# EAGLE design arduino_Uno_mod (EAGLE 8.3.2)
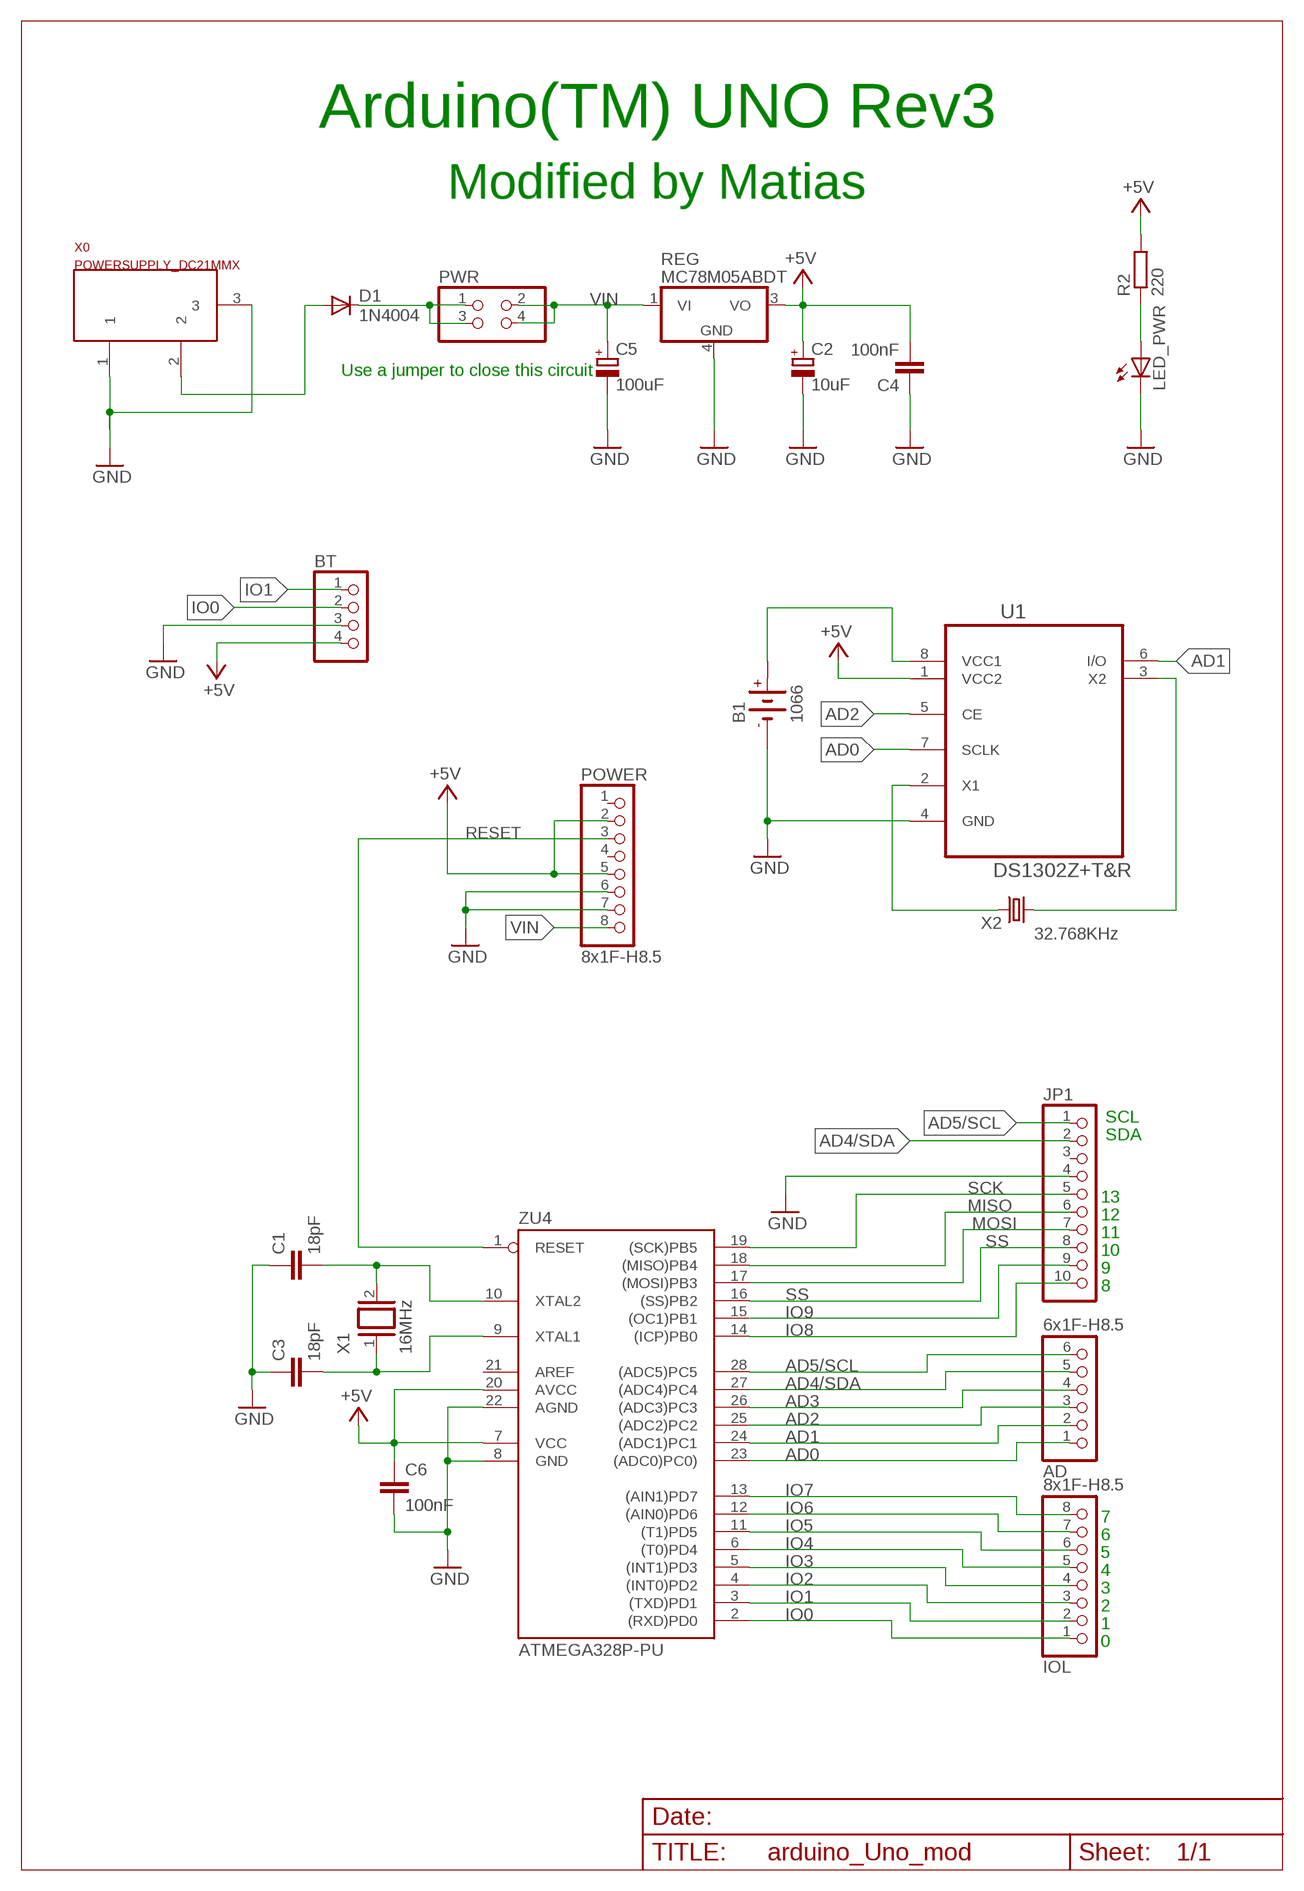
[diagram p0: schematic, sheet 1]

## Parts
AD  6x1F-H8.5  PINHD-1X6  [1X06]
B1  1066  [1066]
BT  PINHD-1X4/90  [1X04/90]
C1  18pF  C-EU025-025X050  [C025-025X050]
C2  10uF  CPOL-EUE2.5-5  [E2,5-5]
C3  18pF  C-EU025-025X050  [C025-025X050]
C4  100nF  C-EU025-025X050  [C025-025X050]
C5  100uF  CPOL-EUE2-5  [E2-5]
C6  100nF  C-EU025-025X050  [C025-025X050]
D1  1N4004  [DO41-10]
IOL  8x1F-H8.5  PINHD-1X8  [1X08]
JP1  PINHD-1X10  [1X10]
LED_PWR  LED3MM  [LED3MM]
POWER  8x1F-H8.5  PINHD-1X8  [1X08]
PWR  PINHD-2X2  [2X02]
R2  220  R-EU_R1206  [R1206]
REG  MC78M05ABDT  [DPACK_3]
U1  DS1302Z+T&R  [SOIC127P600X175-8N]
X0  POWERSUPPLY_DC21MMX  [POWERSUPPLY_DC-21MM]
X1  16MHz  XTAL/S  [QS]
X2  32.768KHz  CRYSTALS-NOGND-WATCH-3X8  [WATCH-3X8]
ZU4  ATMEGA328P-PU  [DIL28-3]

## Nets
+5V [usbvcc]: BT.4 C2.+ C4.2 C6.1 POWER.2 POWER.5 R2.2 REG.3(VO) U1.1(VCC2) ZU4.7(VCC) ZU4.20(AVCC)
AD0: AD.1 U1.7(SCLK) ZU4.23((ADC0)PC0))
AD1: AD.2 U1.6(I/O) ZU4.24((ADC1)PC1)
AD2: AD.3 U1.5(CE) ZU4.25((ADC2)PC2)
AD3: AD.4 ZU4.26((ADC3)PC3)
AD4/SDA: AD.5 JP1.2 ZU4.27((ADC4)PC4)
AD5/SCL: AD.6 JP1.1 ZU4.28((ADC5)PC5)
GND [gnd]: B1.- BT.3 C1.1 C2.- C3.1 C4.1 C5.- C6.2 JP1.4 LED_PWR.K(C) POWER.6 POWER.7 REG.4(GND) U1.4(GND) X0.1 X0.3 ZU4.8(GND) ZU4.22(AGND)
IN [power]: D1.A X0.2
IO0: BT.2 IOL.1 ZU4.2((RXD)PD0)
IO1: BT.1 IOL.2 ZU4.3((TXD)PD1)
IO2: IOL.3 ZU4.4((INT0)PD2)
IO3: IOL.4 ZU4.5((INT1)PD3)
IO4: IOL.5 ZU4.6((T0)PD4)
IO5: IOL.6 ZU4.11((T1)PD5)
IO6: IOL.7 ZU4.12((AIN0)PD6)
IO7: IOL.8 ZU4.13((AIN1)PD7)
IO8: JP1.10 ZU4.14((ICP)PB0)
IO9: JP1.9 ZU4.15((OC1)PB1)
MISO: JP1.6 ZU4.18((MISO)PB4)
MOSI: JP1.7 ZU4.17((MOSI)PB3)
N$1: C3.2 X1.1 ZU4.9(XTAL1)
N$2: LED_PWR.A R2.1
N$4: D1.C PWR.1 PWR.3
N$5: B1.+ U1.8(VCC1)
N$6: U1.2(X1) X2.2
N$7: U1.3(X2) X2.1
RESET: POWER.3 ZU4.1(RESET)
SCK: JP1.5 ZU4.19((SCK)PB5)
SS: JP1.8 ZU4.16((SS)PB2)
VIN [power]: C5.+ POWER.8 PWR.2 PWR.4 REG.1(VI)
XTAL2: C1.2 X1.2 ZU4.10(XTAL2)
Unconnected: JP1.3 POWER.1 POWER.4 ZU4.21(AREF)

## Notes on the sheet
- Arduino(TM) UNO Rev3
- Modified by Matias
- Use a jumper to close this circuit
- SCL
- SDA
- 13
- 12
- 11
- 10
- 9
- 8
- 7
- 6
- 5
- 4
- 3
- 2
- 1
- 0

## Library data of the parts
AD = SmartPrj:PINHD-1X6: PIN HEADER
B1 = 1066:1066: Keystone 1066 Li Coin Cell Holder; AVAILABILITY: Bad; DESCRIPTION: Mini DC/DC Step-Down _Buck_ Converter - 3.3V @ 1A output - TSR12433; MF: Greenlee Communications; MP: 1066; PACKAGE: None; PRICE: 13.82 USD
BT = pinhead:PINHD-1X4: PIN HEADER
C1 C3 C4 C6 = rcl:C-EU: CAPACITOR, European symbol
C2 C5 = rcl:CPOL-EU: POLARIZED CAPACITOR, European symbol
D1 = diode:1N4004: DIODE general purpose rectifier, 1 A
IOL POWER = SmartPrj:PINHD-1X8: PIN HEADER
JP1 = pinhead:PINHD-1X10: PIN HEADER
LED_PWR = led:LED: LED OSRAM: - CHIPLED LG R971, LG N971, LY N971, LG Q971, LY Q971, LO R971, LY R971 LH N974, LH R974 LS Q976, LO Q976, LY Q976 LO Q996 - Hyper CHIPLED LW Q18S LB Q993, LB Q99A, LB R99A - SideLED LS A670, LO A670, LY A670, LG A670, LP A670 LB A673, LV A673, LT A673, LW A673 LH A674 LY A675 LS A676, LA A676, LO A676, LY A676, LW A676 LS A679, LY A679, LG A679 - Hyper Micro SIDELED® LS Y876, LA Y876, LO Y876, LY Y876 LT Y87S - SmartLED LW L88C, LW L88S LB L89C, LB L89S, LG L890 LS L89K, LO L89K, LY L89K LS L896, LA L896, LO L896, LY L896 - TOPLED LS T670, LO T670, LY T670, LG T670, LP T670 LSG T670, LSP T670, LSY T670, LOP T670, LYG T670 LG T671, LOG T671, LSG T671 LB T673, LV T673, LT T673, LW T673 LH T674 LS T676, LA T676, LO T676, LY T676, LB T676, LH T676, LSB T676, LW T676 LB T67C, LV T67C, LT T67C, LS T67K, LO T67K, LY T67K, LW E67C LS E67B, LA E67B, LO E67B, LY E67B, LB E67C, LV E67C, LT E67C LW T67C LS T679, LY T679, LG T679 LS T770, LO T770, LY T770, LG T770, LP T770 LB T773, LV T773, LT T773, LW T773 LH T774 LS E675, LA E675, LY E675, LS T675 LS T776, LA T776, LO T776, LY T776, LB T776 LHGB T686 LT T68C, LB T68C - Hyper Mini TOPLED® LB M676 - Mini TOPLED Santana® LG M470 LS M47K, LO M47K, LY M47K Source: http://www.osram.convergy.de LUXEON: - LUMILED® LXK2-PW12-R00, LXK2-PW12-S00, LXK2-PW14-U00, LXK2-PW14-V00 LXK2-PM12-R00, LXK2-PM12-S00, LXK2-PM14-U00 LXK2-PE12-Q00, LXK2-PE12-R00, LXK2-PE12-S00, LXK2-PE14-T00, LXK2-PE14-U00 LXK2-PB12-K00, LXK2-PB12-L00, LXK2-PB12-M00, LXK2-PB14-N00, LXK2-PB14-P00, LXK2-PB14-Q00 LXK2-PR12-L00, LXK2-PR12-M00, LXK2-PR14-Q00, LXK2-PR14-R00 LXK2-PD12-Q00, LXK2-PD12-R00, LXK2-PD12-S00 LXK2-PH12-R00, LXK2-PH12-S00 LXK2-PL12-P00, LXK2-PL12-Q00, LXK2-PL12-R00 Source: www.luxeon.com KINGBRIGHT: KA-3528ASYC Source: www.kingbright.com
PWR = pinhead:PINHD-2X2: PIN HEADER
R2 = rcl:R-EU_: RESISTOR, European symbol
REG = linear:MC78M: 500 mA Positive Voltage Regulators Source: Data sheet <http://www.onsemi.com/pub_link/Collateral/MC78M00-D.PDF>
U1 = DS1302Z_T_R:DS1302Z+T&R: Trickle-Charge Timekeeping Chip; AVAILABILITY: Good; DESCRIPTION: Real Time Clock Serial 31Byte 8-Pin SOIC N T/R; MF: Maxim Integrated; MP: DS1302Z+T&amp;R; PACKAGE: SOIC-8 Maxim Integrated; PRICE: 1.99 USD
X0 = SmartPrj:POWERSUPPLY_DC21MM
X1 = special:XTAL/S: CRYSTAL
X2 = IQD-Frequency-Products:CRYSTALS-NOGND: CRYSTALS CAN NOT GROUNDED
ZU4 = SmartPrj:ATMEGA328P-: MICROCONTROLLER 4 Kbytes FLASH 128 bytes SRAM 256 bytes EEPROM UART 6-channel 10 bit ADC

## Net classes
0 default: width 0.254 mm, clearance 0.254 mm
1 power: width 0.61 mm, drill 0.61 mm, clearance 0.254 mm
2 gnd: width 0.305 mm, drill 0.559 mm, clearance 0.254 mm
3 usbvcc: width 0.508 mm, drill 0.61 mm, clearance 0.254 mm
4 aref: width 0.406 mm, drill 0.61 mm, clearance 0.254 mm

## Board
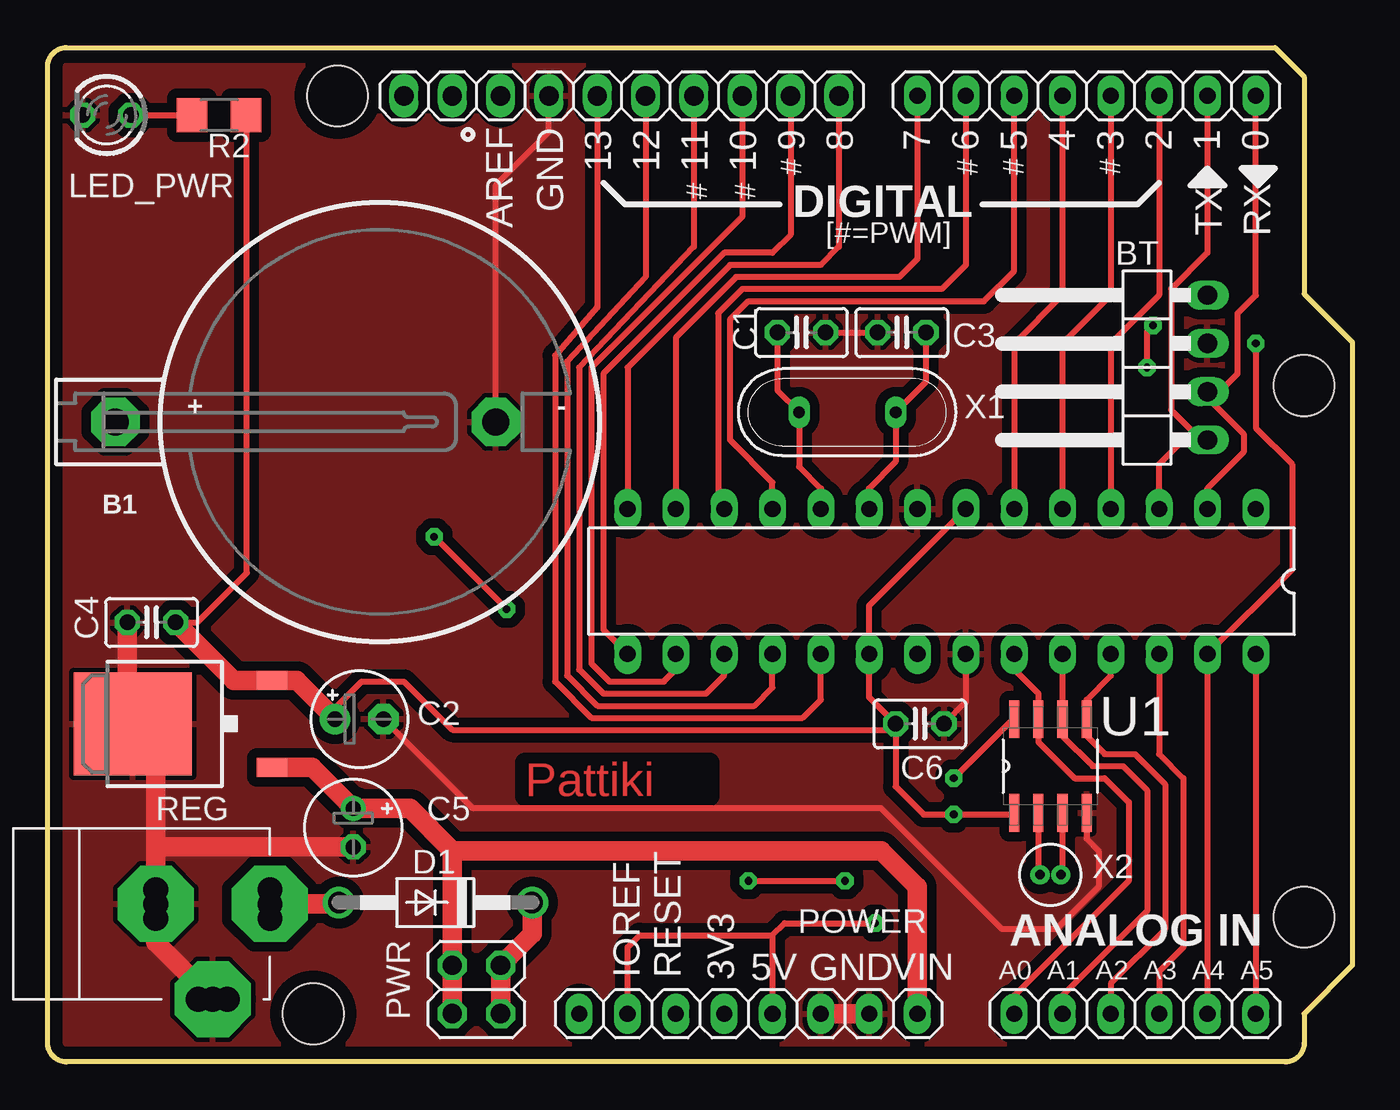
[diagram p1: board, top side]
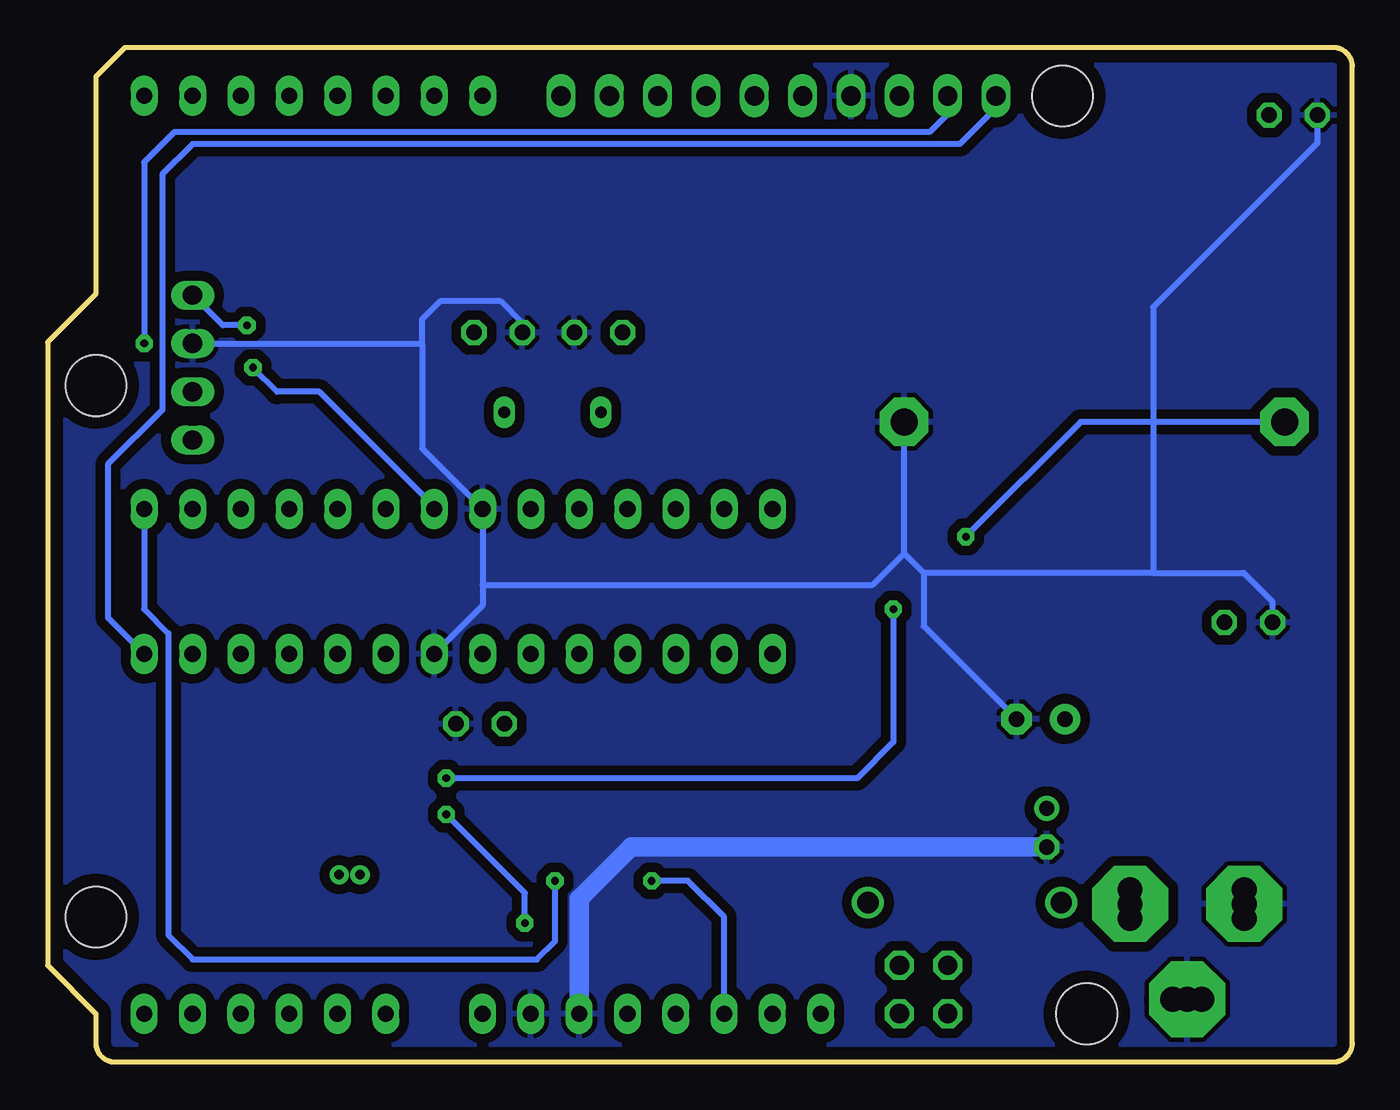
[diagram p2: board, bottom side, seen from below]

Size 68.58 x 53.34 mm. Coordinates in mm from the lower left corner, seen from the top.
Outline: 64.52,53.34 66.04,51.82 66.04,40.39 68.58,37.85 68.58,5.08 66.04,2.54 66.04,1 arc-90 65.04,0 1,0 arc-90 0,1 0,52.34 arc-90 1,53.34 64.52,53.34
Copper layers (1*16): Top 0.035mm / dielectric 1.5mm / Bottom 0.035mm
Design rules "default *": minimum track width 10mil, minimum drill 19mil, track to track 20mil, track to pad 20mil, pad to pad 20mil, via to via 20mil, smd to smd 8mil, copper to edge 26mil, drill to drill 12mil, minimum pad ring 10mil, minimum via ring 10mil, stop-mask expansion 1mil, vias tented up to drill 30mil, thermal gap 10mil
Holes 3.2 mm at 66.04,35.56 66.04,7.62 15.24,50.8 13.97,2.54
vRestrict: area 22.9,44.1 to 24.6,49.1; area 25.4,45.5 to 27.1,49.1; area 28.4,45.3 to 29.6,48.8; area 31,45.3 to 32.1,48.8; area 33.5,45.3 to 34.7,48.8; area 36.1,45.3 to 37.2,48.8; area 38.7,47.2 to 39.9,48.8; area 40.3,45.1 to 47.6,46.9; area 60.3,44.2 to 61.7,46.7; area 62.9,44.2 to 64.3,46.7; area 61.3,35.8 to 64.8,37.2; area 0.6,21.8 to 2,30.1; 14 more areas

### Footprints (pad centres in the part's own frame; a part is rotated, then mirrored left to right if it is on the bottom)
1X06 = drill 0.85 pad 1.422 long: 1 -6.35,0; 2 -3.81,0; 3 -1.27,0; 4 1.27,0; 5 3.81,0; 6 6.35,0
1066 = drill 1.422 pad 2.54 octagon: + 13.9,0; - -6.1,0
1X04/90 = drill 1.016 long: 1 -3.81,-3.81; 2 -1.27,-3.81; 3 1.27,-3.81; 4 3.81,-3.81
C025-025X050 = drill 0.813 octagon: 1 -1.27,0; 2 1.27,0
E2,5-5 = drill 0.813 pad 1.6: + -1.27,0 | drill 0.813 pad 1.6 octagon: - 1.27,0
E2-5 = drill 0.813 pad 1.27: + -1.016,0 | drill 0.813 pad 1.27 octagon: - 1.016,0
DO41-10 = drill 1.118: A 5.08,0; C -5.08,0
1X08 = drill 0.85 pad 1.422 long: 1 -8.89,0; 2 -6.35,0; 3 -3.81,0; 4 -1.27,0; 5 1.27,0; 6 3.81,0; 7 6.35,0; 8 8.89,0
1X10 = drill 1.016 long: 1 -11.43,0; 2 -8.89,0; 3 -6.35,0; 4 -3.81,0; 5 -1.27,0; 6 1.27,0; 7 3.81,0; 8 6.35,0; 9 8.89,0; 10 11.43,0
LED3MM = drill 0.813 octagon: A -1.27,0; K 1.27,0
2X02 = drill 1.016 octagon: 1 -1.27,-1.27; 2 -1.27,1.27; 3 1.27,-1.27; 4 1.27,1.27
R1206 = smd 1.6 x 1.803: 1 -1.422,0; 2 1.422,0
DPACK_3 = smd 1 x 1.6: 1 -2.28,-4.8; 3 2.28,-4.8 | smd 5.4 x 6.2: 4 0,2.5
SOIC127P600X175-8N = smd 1.981 x 0.533: 1 -2.464,1.905; 2 -2.464,0.635; 3 -2.464,-0.635; 4 -2.464,-1.905; 5 2.464,-1.905; 6 2.464,-0.635; 7 2.464,0.635; 8 2.464,1.905
POWERSUPPLY_DC-21MM = drill 1.3 pad 4 octagon: 1 -5.08,-3.353; 2 -0.076,-6.35; 3 -0.076,-0.356 | drill 1.3: 4 -5.08,-4.115; 5 -5.08,-2.591; 6 -0.838,-0.356; 7 0.686,-0.356; 8 -0.838,-6.35; 9 0.686,-6.35
QS = drill 0.61 long: 1 -2.54,0; 2 2.54,0
WATCH-3X8 = drill 0.5 pad 0.9: 1 -0.55,0; 2 0.55,0
DIL28-3 = drill 0.85 pad 1.422 long: 1 -16.51,-3.81; 2 -13.97,-3.81; 3 -11.43,-3.81; 4 -8.89,-3.81; 5 -6.35,-3.81; 6 -3.81,-3.81; 7 -1.27,-3.81; 8 1.27,-3.81; 9 3.81,-3.81; 10 6.35,-3.81; 11 8.89,-3.81; 12 11.43,-3.81; 13 13.97,-3.81; 14 16.51,-3.81; 15 16.51,3.81; 16 13.97,3.81; 17 11.43,3.81; 18 8.89,3.81; 19 6.35,3.81; 20 3.81,3.81; 21 1.27,3.81; 22 -1.27,3.81; 23 -3.81,3.81; 24 -6.35,3.81; 25 -8.89,3.81; 26 -11.43,3.81; 27 -13.97,3.81; 28 -16.51,3.81

### Placement (x,y rotation side)
AD  57.15,2.54 0 top
B1  17.46,33.66 180 top
BT  57.15,36.51 90 top
C1  39.62,38.35 180 top
C2  16.38,18.03 0 top
C3  44.89,38.35 0 top
C4  5.46,23.11 0 top
C5  16.07,12.32 270 top
C6  45.85,17.78 0 top
D1  20.38,8.38 180 top
IOL  54.61,50.8 180 top
JP1  30.16,50.8 0 top
LED_PWR  3.11,49.78 180 top
POWER  36.83,2.54 0 top
PWR  22.54,3.81 90 top
R2  9.02,49.78 0 top
REG  6.99,17.78 90 top
U1  52.7,15.56 90 top
X0  5.33,8.38 90 top
X1  42.04,34.16 180 top
X2  52.7,9.84 180 top
ZU4  46.99,25.27 180 top

### Tracks (layer width: path | path; a pad name or v marks a point on that pad's centre or on a via)
+5V  (via drill 0.4)
  Top 0.305: C4.2 7.87,23.11 10.48,25.72 10.48,49.74 R2.2 | C6.1 44.58,14.48 46.04,13.02 v47.62,13.02 50.72,13.02 U1.1 | C6.1 43.18,19.18 ZU4.20 43.18,24 ZU4.7 | C2.+ 15.11,18.61 16.51,20 18.73,20 21.27,17.46 44.26,17.46 C6.1 | 38.1,6.67 POWER.5 | 38.1,6.67 38.73,7.3 v43.5,7.3 | v57.78,36.51 57.78,38.42 v58.1,38.73 | POWER.2 30.48,6.03 31.11,6.67 38.1,6.67
  Top 1.016: C2.+ 13.09,20.06 REG.3 9.79,20.06 C4.2
  Bottom 0.305: v43.5,7.3 43.5,8.89 v47.62,13.02 | ZU4.7 48.26,29.21 54.29,35.24 56.52,35.24 v57.78,36.51 | v58.1,38.73 59.37,38.73 BT.4
AD0
  Top 0.305: ZU4.23 50.8,20.64 52.07,19.37 U1.7 52.07,16.83 53.98,14.92 55.56,14.92 56.83,13.65 56.83,9.53 50.8,3.49 AD.1
AD1
  Top 0.305: ZU4.24 U1.6 53.34,17.14 54.93,15.56 56.52,15.56 57.78,14.29 57.78,7.94 53.34,3.49 AD.2
AD2
  Top 0.305: ZU4.25 55.88,20.32 54.61,19.05 U1.5 54.61,17.14 55.56,16.19 57.15,16.19 58.74,14.61 58.74,6.99 55.88,4.13 AD.3
AD3
  Top 0.305: ZU4.26 58.42,16.19 59.69,14.92 59.69,6.03 58.42,4.76 AD.4
AD4/SDA  (via drill 0.4)
  Top 0.305: AD.5 ZU4.27 65.41,25.91 65.41,31.43 63.5,33.34 v63.5,37.78
  Bottom 0.305: JP1.2 21.27,49.85 22.23,48.9 61.91,48.9 63.5,47.31 v63.5,37.78
AD5/SCL
  Top 0.305: ZU4.28 AD.6
  Bottom 0.305: JP1.1 18.73,50.16 20.64,48.26 60.96,48.26 62.55,46.67 62.55,34.29 65.41,31.43 65.41,23.37 ZU4.28
GND
  Top 0.305: C1.1 C3.1 | U1.4 54.61,11.75 55.24,11.11 55.24,9.21 53.02,6.99 50.16,6.99 43.81,13.34 22.35,13.34 C2.- | ZU4.22 48.26,18.92 C6.2 | B1.- 23.56,46.1 26.35,48.9 JP1.4
  Top 1.016: 5.69,11.11 5.69,16.57 REG.4 4.19,18.07 C4.1 | 5.69,11.11 X0.3 5.69,6.3 X0.1 | C5.- 5.88,11.3 5.69,11.11 | POWER.7 POWER.6
  Bottom 0.305: 22.54,25.72 22.54,22.92 C2.- | C4.1 4.19,24.19 5.71,25.72 10.48,25.72 | 10.48,25.72 22.54,25.72 | LED_PWR.K 1.84,48.32 10.48,39.69 10.48,25.72 | ZU4.22 45.72,24 45.72,25.08 | C3.1 43.62,38.86 44.77,40.01 47.94,40.01 48.9,39.05 48.9,37.78 | 48.9,37.78 48.9,32.26 ZU4.8 45.72,25.08 | 23.56,26.74 B1.- | 23.56,26.74 22.54,25.72 | 45.72,25.08 25.22,25.08 23.56,26.74 | BT.3 48.9,37.78
  Bottom 1.016: C5.- 37.91,11.3 40.64,8.57 POWER.6
  pour Top: 0,53.34 64.45,53.34 66.04,51.75 66.04,40.32 68.58,37.78 68.58,5.08 66.04,2.54 66.04,0.64 65.72,0.32 0.64,0.32 -0.32,1.27 -0.32,53.02
  pour Bottom: 0,53.34 64.45,53.34 66.04,51.75 66.04,40.32 68.58,37.78 68.58,5.08 66.04,2.54 66.04,0.32 65.72,0 0.64,0 0,0.64
IN
  Top 1.016: X0.2 15.23,8.31 D1.A
IO0
  Top 0.305: IOL.1 63.5,40.32 62.55,39.37 62.55,36.2 61.59,35.24 BT.2 60.96,34.92 62.87,33.02 62.87,32.07 60.96,30.16 ZU4.2
IO1
  Top 0.305: IOL.2 60.96,42.55 59.05,40.64 59.05,34.29 60.64,32.7 | ZU4.3 58.42,31.43 59.69,32.7 60.64,32.7 | 60.64,32.7 BT.1
IO2
  Top 0.305: IOL.3 58.42,40.32 55.88,37.78 ZU4.4
IO3
  Top 0.305: IOL.4 55.88,40.32 53.34,37.78 ZU4.5
IO4
  Top 0.305: IOL.5 53.34,40.32 50.8,37.78 ZU4.6
IO5
  Top 0.305: ZU4.11 38.1,30.48 35.88,32.7 35.88,39.05 36.83,40.01 49.21,40.01 50.8,41.59 IOL.6
IO6
  Top 0.305: IOL.7 48.26,41.91 46.99,40.64 36.51,40.64 35.24,39.37 35.24,29.4 ZU4.12
IO7
  Top 0.305: IOL.8 45.72,42.23 44.77,41.27 36.2,41.27 33.02,38.1 ZU4.13
IO8
  Top 0.305: JP1.10 41.59,42.86 40.64,41.91 35.88,41.91 30.48,36.51 ZU4.14
IO9
  Top 0.305: JP1.9 39.05,43.5 38.1,42.55 35.56,42.55 29.21,36.2 29.21,22.73 ZU4.15
MISO
  Top 0.305: JP1.6 31.43,41.27 27.3,36.83 27.3,20.32 28.89,18.73 37.15,18.73 38.1,19.68 ZU4.18
MOSI
  Top 0.305: JP1.7 33.97,42.86 27.94,36.51 27.94,20.64 29.21,19.37 34.61,19.37 35.56,20.32 ZU4.17
N$1
  Top 0.305: ZU4.9 43.18,30.16 44.58,31.56 X1.1 46.16,35.75 C3.2
N$2
  Top 0.305: LED_PWR.A R2.1
N$4
  Top 1.016: PWR.1 PWR.3 25.46,6.73 D1.C
N$5  (via drill 0.4)
  Top 0.305: U1.8 50.72,18.02 v47.62,14.92 | v20.32,27.62 v24.13,23.81
  Bottom 0.305: B1.+ 14.29,33.66 v20.32,27.62 | v24.13,23.81 24.13,16.83 26.04,14.92 v47.62,14.92
N$6
  Top 0.305: U1.2 52.07,9.93 X2.2
N$7
  Top 0.305: U1.3 53.34,9.93 X2.1
RESET  (via drill 0.4)
  Top 0.305: v36.83,9.53 v41.91,9.53
  Bottom 0.305: POWER.3 33.02,7.62 34.92,9.53 v36.83,9.53 | ZU4.1 63.5,23.81 62.23,22.54 62.23,6.67 60.96,5.4 42.86,5.4 41.91,6.35 v41.91,9.53
SCK
  Top 0.305: JP1.5 28.89,39.69 26.67,37.15 26.67,20 28.57,18.1 39.69,18.1 40.64,19.05 ZU4.19
SS
  Top 0.305: JP1.8 36.51,44.45 28.57,36.51 28.57,20.95 29.53,20 32.38,20 33.02,20.64 ZU4.16
VIN
  Top 1.016: PWR.2 PWR.4 21.27,11.11 | 21.27,11.11 19.05,13.34 C5.+ 13.9,15.5 REG.1 12.12,15.5 | POWER.8 45.72,9.21 43.81,11.11 21.27,11.11
XTAL2
  Top 0.305: ZU4.10 40.64,30.16 39.5,31.3 X1.2 38.35,35.31 C1.2

### Text on the board
Top: Pattiki
tPlace: 13 | 12 | 11 | 10 | 9 | 8 | 7 | 6 | 5 | 4 | 3 | 2 | 1 | 0
tNames: AREF | GND | # | # | # | # | # | # | DIGITAL | [#=PWM] | TX | RX | ANALOG IN | IOREF | RESET | 3V3 | 5V | GND | VIN | A0 | A1 | A2 | A3 | A4 | A5
ReferenceLC: L | TX | ON | RX | PC1 | PC2
214bmp: D:/SmartProjects/Snc/a4_bn_logo2.bmp